# Altium schematic sheet 2_MODUE.schdoc
size 312 x 225 mm; SheetNumber: 2; SheetTotal: 3
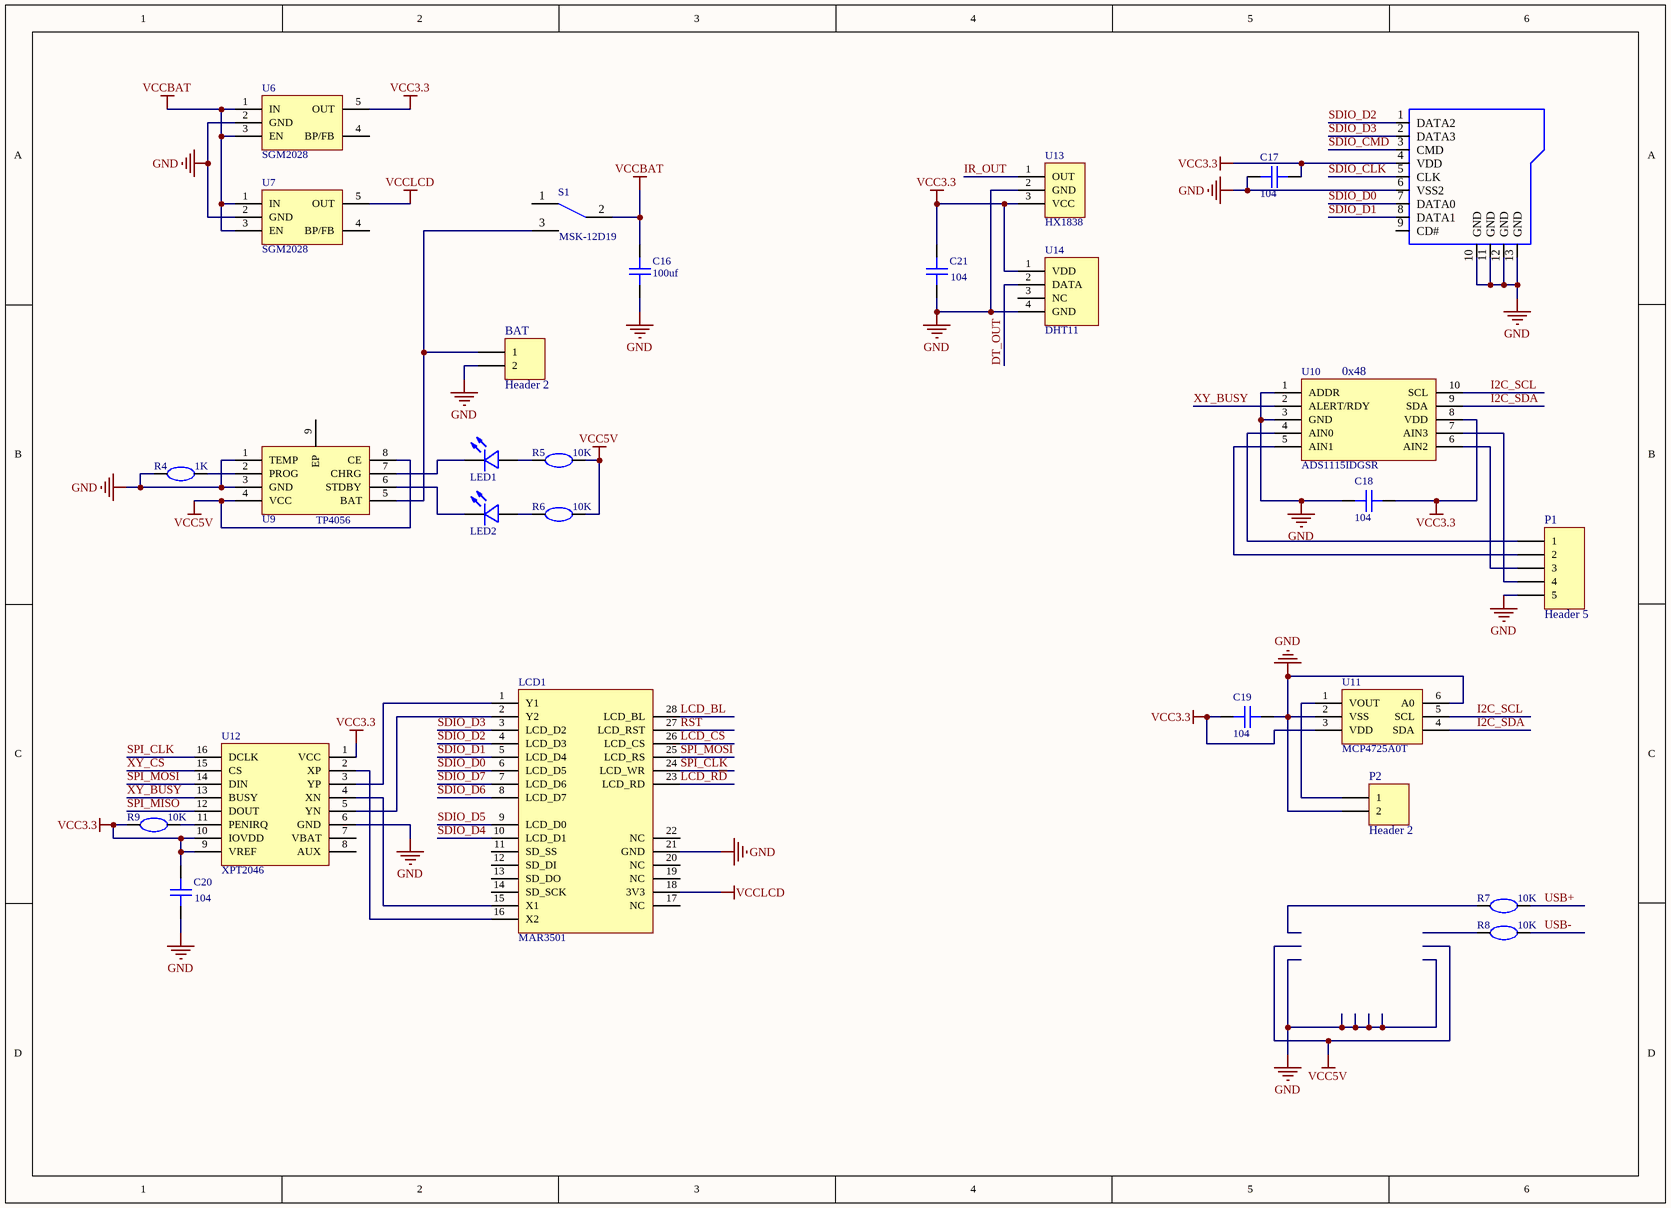
[diagram p0: 2_MODUE.schdoc]

## Parts
BAT  Header 2  [HDR1X2]
C16  100uf  [3528]
C17  104  [0402R]
C18  104  [0402R]
C19  104  [0402R]
C20  104  [0402R]
C21  104  [0402R]
LCD1  MAR3501  [MAR3501]
LED1  L-C292WDT-5A-YY  [0805]  (value not drawn)
LED2  L-C292WDT-5A-YY  [0805]  (value not drawn)
P1  Header 5  [HDR1X5]
P2  Header 2  [HDR1X2]
R4  1K  [0402R]
R5  10K  [0402R]
R6  10K  [0402R]
R7  10K  [0805]
R8  10K  [0805]
R9  10K  [0402R]
S1  MSK-12D19  [MSK-12D19]
TF1  TF  [TF-SMD_XKTF-N02-N_1]  (value not drawn)
U6  SGM2028  [SOT-23-5_L3.0-W1.7-P0.95-LS2.8-BR]
U7  SGM2028  [SOT-23-5_L3.0-W1.7-P0.95-LS2.8-BR]
U9  TP4056  [ESOP-8_L4.9-W3.9-P1.27-LS6.0-BL-EP]
U10  ADS1115IDGSR  [MSOP-10_L3.0-W3.0-P0.50-LS5.0-BL]
U11  MCP4725A0T  [SOT-23-6_L2.9-W1.6-P0.95-LS2.8-BR]
U12  XPT2046  [TSSOP-16_L5.0-W4.4-P0.65-LS6.4-BL]
U13  HX1838  [HX1838]
U14  DHT11  [SENSOR-TH_DHT11]

## Nets
GND: BAT.2 C16.1 C17.2 C18.2 C19.2 C20.1 C21.1 LCD1.21(GND) P1.5 P2.2 R4.1 TF1.6(VSS2) TF1.10(GND) TF1.11(GND) TF1.12(GND) TF1.13(GND) U6.2(GND) U7.2(GND) U9.1(TEMP) U9.3(GND) U10.1(ADDR) U10.3(GND) U11.2(VSS) U11.6(A0) U12.6(GND) U13.2(GND) U14.4(GND)
VCC3.3: C17.1 C18.1 C19.1 C20.2 C21.2 R9.1 TF1.4(VDD) U6.5(OUT) U10.8(VDD) U11.3(VDD) U12.1(VCC) U12.9(VREF) U12.10(IOVDD) U13.3(VCC) U14.1(VDD)
VCC5V: R5.2 R6.2 U9.4(VCC) U9.8(CE)
VCCBAT: C16.2 S1.2(B) U6.1(IN) U6.3(EN) U7.1(IN) U7.3(EN)
VCCLCD: LCD1.18(3V3) U7.5(OUT)
DT_OUT: U14.2(DATA)
I2C_SCL: U10.10(SCL) U11.5(SCL)
I2C_SDA: U10.9(SDA) U11.4(SDA)
IR_OUT: U13.1(OUT)
LCD_BL: LCD1.28(LCD_BL)
LCD_CS: LCD1.26(LCD_CS)
LCD_R~{D}: LCD1.23(LCD_RD)
RST: LCD1.27(LCD_RST)
SDIO_CLK: TF1.5(CLK)
SDIO_CMD: TF1.3(CMD)
SDIO_D0: LCD1.6(LCD_D5) TF1.7(DATA0)
SDIO_D1: LCD1.5(LCD_D4) TF1.8(DATA1)
SDIO_D2: LCD1.4(LCD_D3) TF1.1(DATA2)
SDIO_D3: LCD1.3(LCD_D2) TF1.2(DATA3)
SDIO_D4: LCD1.10(LCD_D1)
SDIO_D5: LCD1.9(LCD_D0)
SDIO_D6: LCD1.8(LCD_D7)
SDIO_D7: LCD1.7(LCD_D6)
SPI_CLK: LCD1.24(LCD_WR) U12.16(DCLK)
SPI_MISO: U12.12(DOUT)
SPI_MOSI: LCD1.25(LCD_RS) U12.14(DIN)
USB+: R7.2
USB-: R8.2
XY_BUSY: U10.2(ALERT/RDY) U12.13(BUSY)
XY_CS: U12.15(CS)
NetBAT_1: BAT.1 S1.3(C) U9.5(BAT)
NetLCD1_1: LCD1.1(Y1) U12.3(YP)
NetLCD1_2: LCD1.2(Y2) U12.5(YN)
NetLCD1_15: LCD1.15(X1) U12.4(XN)
NetLCD1_16: LCD1.16(X2) U12.2(XP)
NetLED1_1: LED1.1(+) R5.1
NetLED1_2: LED1.2(-) U9.7(CHRG)
NetLED2_1: LED2.1(+) R6.1
NetLED2_2: LED2.2(-) U9.6(STDBY)
NetP1_1: P1.1 U10.4(AIN0)
NetP1_2: P1.2 U10.5(AIN1)
NetP1_3: P1.3 U10.6(AIN2)
NetP1_4: P1.4 U10.7(AIN3)
NetP2_1: P2.1 U11.1(VOUT)
NetR4_2: R4.2 U9.2(PROG)
NetR9_2: R9.2 U12.11(PENIRQ)

Not connected (* = marked no-connect by the designer): LCD1 11(SD_SS) 12(SD_DI) 13(SD_DO) 14(SD_SCK) 17(NC) 19(NC) 20(NC) 22(NC); R7 1; R8 1; S1 1(A); TF1 9(CD#); U6 4(BP/FB); U7 4(BP/FB); U9 9(EP); U12 7(VBAT) 8(AUX); U14 3(NC)

## Notes on the sheet
- (near U10) 0x48

## Library data of the parts
BAT P2 = Header 2: Header, 2-Pin; LatestRevisionDate: 17-Jul-2002; LatestRevisionNote: Re-released for DXP Platform.; Publisher: Altium Limited
C16-C21 = CAP: Symbol: 0.1u; Add into BOM: yes; Origin Footprint: C0805; Device: 0.1u; Convert to PCB: yes
LCD1 = MAR3501: Add into BOM: yes; Symbol: MAR3501; Device: MAR3501; Convert to PCB: yes; Origin Footprint: MAR3501
LED1 LED2 = LED: Add into BOM: yes; Origin Footprint: LED0805-RD; Symbol: L-C292WDT-5A-YY; Name: L-C292WDT-5A-YY; Device: L-C292WDT-5A-YY; Convert to PCB: yes
P1 = Header 5: Header, 5-Pin; LatestRevisionDate: 17-Jul-2002; LatestRevisionNote: Re-released for DXP Platform.; Publisher: Altium Limited
R4-R9 = RST: Symbol: 0_; Add into BOM: yes; Origin Footprint: R0805; Device: 0_; Convert to PCB: yes
S1 = MSK-12D19: Add into BOM: yes; Symbol: MSK-12D19; Device: MSK-12D19; Convert to PCB: yes; Origin Footprint: MSK-12D19; Name: MSK-12D19
TF1 = TF: Symbol: TF_1; Add into BOM: yes; Device: TF_1; Convert to PCB: yes
U6 U7 = SGM2028: Symbol: SGM2028-3.3YN5G/TR; Add into BOM: yes; Device: SGM2028-3.3YN5G/TR; Convert to PCB: yes; Origin Footprint: SOT-23-5_L3.0-W1.7-P0.95-LS2.8-BR
U9 = TP4056: Symbol: TP4056_C725790; Add into BOM: yes; Device: TP4056_C725790; Convert to PCB: yes; Origin Footprint: ESOP-8_L4.9-W3.9-P1.27-LS6.0-BL-EP
U10 = ADS1115IDGSR: Add into BOM: yes; Symbol: ADS1115IDGSR; Device: ADS1115IDGSR; Convert to PCB: yes; Origin Footprint: MSOP-10_L3.0-W3.0-P0.50-LS5.0-BL
U11 = MCP4725A0T: Symbol: MCP4725A0T-E/CH; Add into BOM: yes; Device: MCP4725A0T-E/CH; Convert to PCB: yes; Origin Footprint: SOT-23-6_L2.9-W1.6-P0.95-LS2.8-BR
U12 = XPT2046: Add into BOM: yes; Symbol: XPT2046; Device: XPT2046; Convert to PCB: yes; Origin Footprint: TSSOP-16_L5.0-W4.4-P0.65-LS6.4-BL
U13 = HX1838: Add into BOM: yes; Symbol: HX1838; Device: HX1838; Convert to PCB: yes; Origin Footprint: HX1838; link: HX1838
U14 = DHT11: Add into BOM: yes; Symbol: DHT11; Device: DHT11; Convert to PCB: yes; Origin Footprint: SENSOR-TH_DHT11